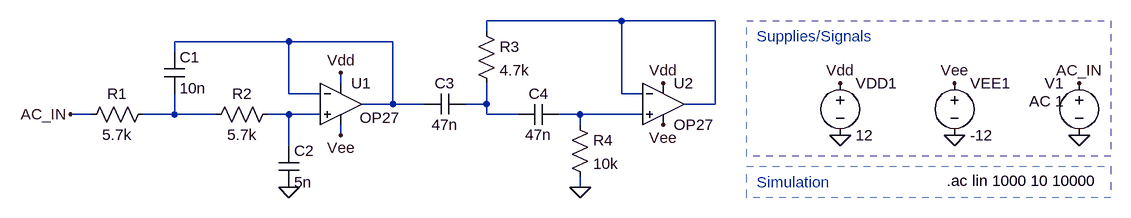
[diagram p0: schematic Draft8.asc]
Draft8.asc, the LTspice schematic file:
Version 4
SHEET 1 1268 680
WIRE 368 -32 160 -32
WIRE 512 -32 368 -32
WIRE 160 -16 160 -32
WIRE -144 0 -320 0
WIRE 16 0 -144 0
WIRE -320 16 -320 0
WIRE -64 64 -64 48
WIRE -144 80 -144 0
WIRE -96 80 -144 80
WIRE 368 80 368 -32
WIRE 400 80 368 80
WIRE 16 96 16 0
WIRE 16 96 -32 96
WIRE 64 96 16 96
WIRE 160 96 160 64
WIRE 160 96 128 96
WIRE 512 96 512 -32
WIRE 512 96 464 96
WIRE -448 112 -480 112
WIRE -320 112 -320 80
WIRE -320 112 -368 112
WIRE -256 112 -320 112
WIRE -144 112 -176 112
WIRE -96 112 -144 112
WIRE 160 112 160 96
WIRE 208 112 160 112
WIRE 304 112 272 112
WIRE 400 112 304 112
WIRE 304 128 304 112
WIRE -64 144 -64 128
WIRE -144 160 -144 112
WIRE 304 224 304 208
FLAG -64 48 Vdd
FLAG -64 144 Vee
FLAG -144 224 0
FLAG 432 64 Vdd
FLAG 432 128 Vee
FLAG 304 224 0
FLAG 1072 144 0
FLAG 1072 64 AC_IN
FLAG 704 144 0
FLAG 880 144 0
FLAG 704 64 Vdd
FLAG 880 64 Vee
FLAG -480 112 AC_IN
SYMBOL Opamps\\OP27 -64 32 R0
WINDOW 3 29 85 Left 2
SYMATTR InstName U1
SYMBOL res -352 96 R90
WINDOW 0 0 56 VBottom 2
WINDOW 3 32 56 VTop 2
SYMATTR InstName R1
SYMATTR Value 5.7k
SYMBOL res -160 96 R90
WINDOW 0 0 56 VBottom 2
WINDOW 3 32 56 VTop 2
SYMATTR InstName R2
SYMATTR Value 5.7k
SYMBOL cap -336 16 R0
SYMATTR InstName C1
SYMATTR Value 10n
SYMBOL cap -160 160 R0
SYMATTR InstName C2
SYMATTR Value 5n
SYMBOL cap 128 80 R90
WINDOW 0 0 32 VBottom 2
WINDOW 3 32 32 VTop 2
SYMATTR InstName C3
SYMATTR Value 47n
SYMBOL cap 272 96 R90
WINDOW 0 0 32 VBottom 2
WINDOW 3 32 32 VTop 2
SYMATTR InstName C4
SYMATTR Value 47n
SYMBOL res 144 -32 R0
SYMATTR InstName R3
SYMATTR Value 4.7k
SYMBOL res 288 112 R0
SYMATTR InstName R4
SYMATTR Value 10k
SYMBOL Opamps\\OP27 432 32 R0
SYMATTR InstName U2
SYMBOL voltage 1072 48 M0
WINDOW 3 210 96 Right 2
WINDOW 123 24 44 Left 2
WINDOW 39 0 0 Left 0
SYMATTR Value ""
SYMATTR Value2 AC 1
SYMATTR InstName V1
SYMBOL voltage 704 48 R0
SYMATTR InstName VDD1
SYMATTR Value 12
SYMBOL voltage 880 48 R0
SYMATTR InstName VEE1
SYMATTR Value -12
TEXT 868 214 Left 2 !.ac lin 1000 10 10000
TEXT 576 -8 Left 2 ;Supplies/Signals
TEXT 576 216 Left 2 ;Simulation
RECTANGLE Normal 1120 176 560 -32 2
RECTANGLE Normal 1120 240 560 192 2

The netlist it stands for:
* Draft8.asc
XU1 N005 N002 Vdd Vee N002 OP27  ; pins In+ In- V+ V- OUT
R1 N004 AC_IN 5.7k
R2 N005 N004 5.7k
C1 N002 N004 10n
C2 N005 0 5n
C3 N003 N002 47n
C4 N006 N003 47n
R3 N001 N003 4.7k
R4 N006 0 10k
XU2 N006 N001 Vdd Vee N001 OP27  ; pins In+ In- V+ V- OUT
V1 AC_IN 0 AC 1
VDD1 Vdd 0 12
VEE1 Vee 0 -12
.ac lin 1000 10 10000
* Supplies/Signals
* Simulation
.lib ADI.lib
.backanno
.end